# Altium project SprinklerBoard.PrjPCB
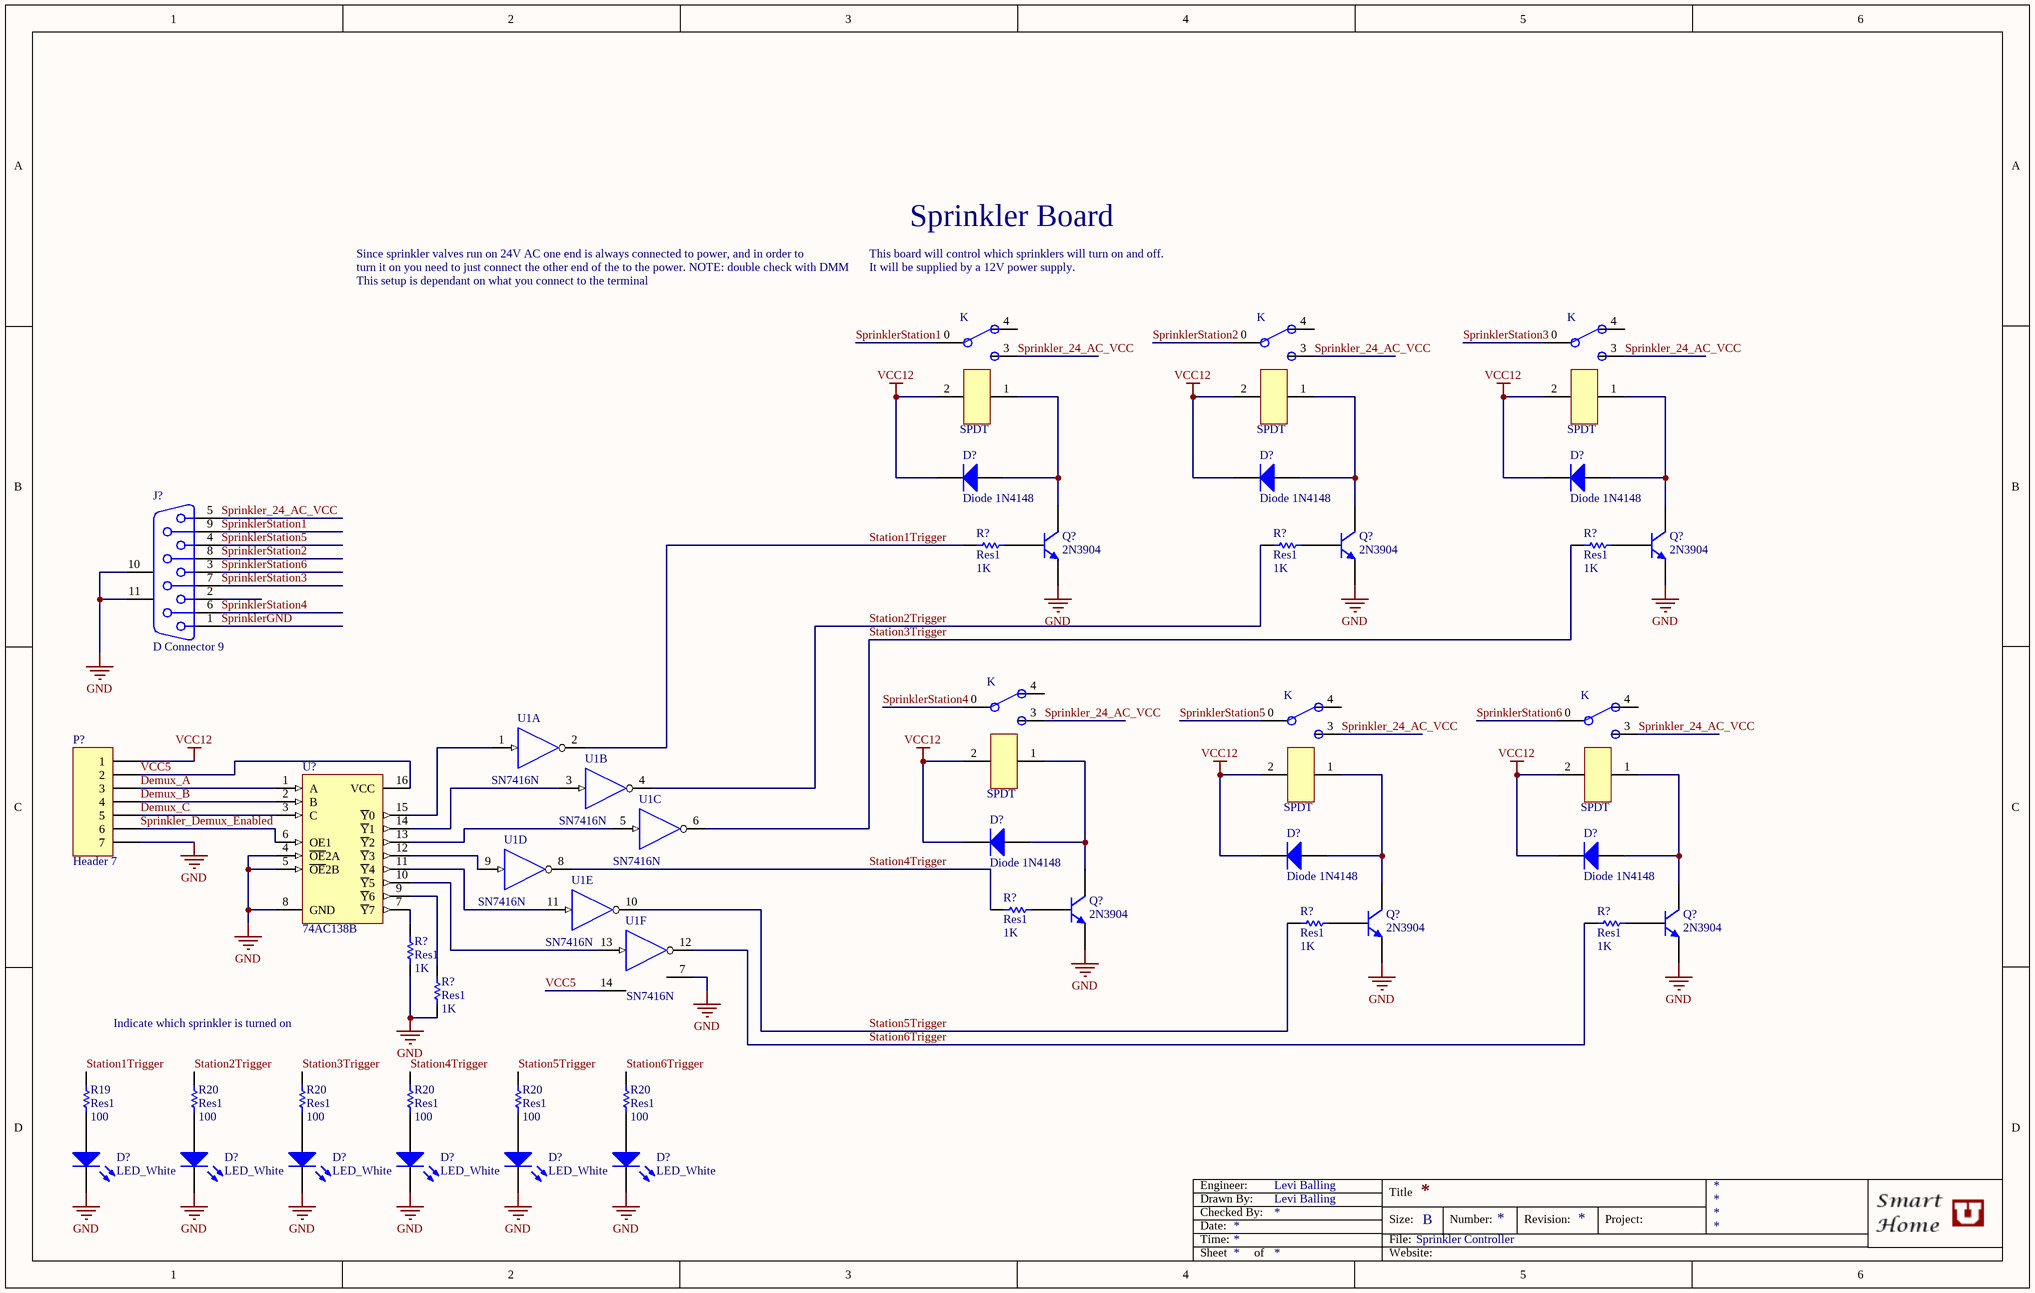
[diagram p0: SprinklerBoard.SchDoc]
1 sheet, 42 parts. Net scope: global (net labels, ports and power ports of the same name join across sheets).

## Sheet SprinklerBoard.SchDoc
size B; DrawnBy: Levi Balling; Engineer: Levi Balling; DocumentName: Sprinkler Controller

### Parts
(Parts that share a designator on the sheet are numbered #1, #2 ... from top to bottom, then left to right.)
D?#1  Diode 1N4148  [DO-35]
D?#2  Diode 1N4148  [DO-35]
D?#3  Diode 1N4148  [DO-35]
D?#4  Diode 1N4148  [DO-35]
D?#5  Diode 1N4148  [DO-35]
D?#6  Diode 1N4148  [DO-35]
D?#7  LED_White  [LED-0]
D?#8  LED_White  [LED-0]
D?#9  LED_White  [LED-0]
D?#10  LED_White  [LED-0]
D?#11  LED_White  [LED-0]
D?#12  LED_White  [LED-0]
J?  D Connector 9  [DSUB1.385-2H9]
K#1  SPDT  [Relay  SPDT]
K#2  SPDT  [Relay  SPDT]
K#3  SPDT  [Relay  SPDT]
K#4  SPDT  [Relay  SPDT]
K#5  SPDT  [Relay  SPDT]
K#6  SPDT  [Relay  SPDT]
P?  Header 7  [HDR1X7]
Q?#1  2N3904  [2N3904]
Q?#2  2N3904  [2N3904]
Q?#3  2N3904  [2N3904]
Q?#4  2N3904  [2N3904]
Q?#5  2N3904  [2N3904]
Q?#6  2N3904  [2N3904]
R19  Res1  value 100  [AXIAL-0.3]
R20#1  Res1  value 100  [AXIAL-0.3]
R20#2  Res1  value 100  [AXIAL-0.3]
R20#3  Res1  value 100  [AXIAL-0.3]
R20#4  Res1  value 100  [AXIAL-0.3]
R20#5  Res1  value 100  [AXIAL-0.3]
R?#1  Res1  value 1K  [AXIAL-0.3]
R?#2  Res1  value 1K  [AXIAL-0.3]
R?#3  Res1  value 1K  [AXIAL-0.3]
R?#4  Res1  value 1K  [AXIAL-0.3]
R?#5  Res1  value 1K  [AXIAL-0.3]
R?#6  Res1  value 1K  [AXIAL-0.3]
R?#7  Res1  value 1K  [AXIAL-0.3]
R?#8  Res1  value 1K  [AXIAL-0.3]
U1  SN7416N  [N014]  (parts A,B,C,D,E,F of 6)
U?  74AC138B  [DIP16]

### Nets
GND: D?#7.2(K) D?#8.2(K) D?#9.2(K) D?#10.2(K) D?#11.2(K) D?#12.2(K) J?.10(MH1) J?.11(MH2) P?.7 Q?#1.1(E) Q?#2.1(E) Q?#3.1(E) Q?#4.1(E) Q?#5.1(E) Q?#6.1(E) R?#7.1 R?#8.1 U1.7(GND) U?.4(~{OE}2A) U?.5(~{OE}2B) U?.8(GND)
VCC: U1.14(VCC)
VCC12: D?#1.2(K) D?#2.2(K) D?#3.2(K) D?#4.2(K) D?#5.2(K) D?#6.2(K) K#1.2 K#2.2 K#3.2 K#4.2 K#5.2 K#6.2 P?.1
Demux_A: P?.3 U?.1(A)
Demux_B: P?.4 U?.2(B)
Demux_C: P?.5 U?.3(C)
Sprinkler_24_AC_VCC: J?.5 K#1.3 K#2.3 K#3.3 K#4.3 K#5.3 K#6.3
Sprinkler_Demux_Enabled: P?.6 U?.6(OE1)
SprinklerGND: J?.1
SprinklerStation1: J?.9 K#1.0
SprinklerStation2: J?.8 K#2.0
SprinklerStation3: J?.7 K#3.0
SprinklerStation4: J?.6 K#4.0
SprinklerStation5: J?.4 K#5.0
SprinklerStation6: J?.3 K#6.0
Station1Trigger: R19.1 R?#1.2 U1.2(Y)
Station2Trigger: R20#1.1 R?#2.2 U1.4(Y)
Station3Trigger: R20#2.1 R?#3.2 U1.6(Y)
Station4Trigger: R20#3.1 R?#4.2 U1.8(Y)
Station5Trigger: R20#4.1 R?#5.2 U1.10(Y)
Station6Trigger: R20#5.1 R?#6.2 U1.12(Y)
VCC5: P?.2 U1.14(VCC) U?.16(VCC)
NetD?#1_1: D?#1.1(A) K#1.1 Q?#1.3(C)
NetD?#2_1: D?#2.1(A) K#2.1 Q?#2.3(C)
NetD?#3_1: D?#3.1(A) K#3.1 Q?#3.3(C)
NetD?#4_1: D?#4.1(A) K#4.1 Q?#4.3(C)
NetD?#5_1: D?#5.1(A) K#5.1 Q?#5.3(C)
NetD?#6_1: D?#6.1(A) K#6.1 Q?#6.3(C)
NetD?#7_1: D?#7.1(A) R19.2
NetD?#8_1: D?#8.1(A) R20#1.2
NetD?#9_1: D?#9.1(A) R20#2.2
NetD?#10_1: D?#10.1(A) R20#3.2
NetD?#11_1: D?#11.1(A) R20#4.2
NetD?#12_1: D?#12.1(A) R20#5.2
NetQ?#1_2: Q?#1.2(B) R?#1.1
NetQ?#2_2: Q?#2.2(B) R?#2.1
NetQ?#3_2: Q?#3.2(B) R?#3.1
NetQ?#4_2: Q?#4.2(B) R?#4.1
NetQ?#5_2: Q?#5.2(B) R?#5.1
NetQ?#6_2: Q?#6.2(B) R?#6.1
NetR?#7_2: R?#7.2 U?.7(~{Y}7)
NetR?#8_2: R?#8.2 U?.9(~{Y}6)
NetU1_1: U1.1(A) U?.15(~{Y}0)
NetU1_3: U1.3(A) U?.14(~{Y}1)
NetU1_5: U1.5(A) U?.13(~{Y}2)
NetU1_9: U1.9(A) U?.12(~{Y}3)
NetU1_11: U1.11(A) U?.11(~{Y}4)
NetU1_13: U1.13(A) U?.10(~{Y}5)

Not connected (* = marked no-connect by the designer): J? 2; K#1 4; K#2 4; K#3 4; K#4 4; K#5 4; K#6 4

### Notes on the sheet
- Sprinkler Board
- Since sprinkler valves run on 24V AC one end is always connected to power, and in order to
- turn it on you need to just connect the other end of the to the power. NOTE: double check with DMM
- This setup is dependant on what you connect to the terminal
- This board will control which sprinklers will turn on and off.
- It will be supplied by a 12V power supply.
- Indicate which sprinkler is turned on
- Date:
- Time:
- Engineer:
- Drawn By:
- Checked By:
- Title
- Size:
- File:
- B
- Number:
- Revision:
- Project:
- Sheet
- of
- Website:

### Library data of the parts
D?#1-D?#6 = Diode 1N4148: High Conductance Fast Diode; Published: 8-Jun-2000; LatestRevisionDate: 17-Jul-2002; LatestRevisionNote: Re-released for DXP Platform.; DatasheetVersion: 1997; PackageReference: DO-35; Publisher: Altium Limited; PackageDescription: Diode, Axial; Body 3.8 x 1.9 mm (LxDia. max), Lead Dia. 0.53 mm (max); Code_JEDEC: DO-204-AH; ComponentLink1Description: Manufacturer Link; ComponentLink1URL: http://www.fairchildsemi.com/; ComponentLink2Description: Datasheet; ComponentLink2URL: http://www.fairchildsemi.com/ds/1N%2F1N4148.pdf
D?#7-D?#12 = LED0: Typical INFRARED GaAs LED; Published: 8-Jun-2000; LatestRevisionDate: 08-Jul-2005; LatestRevisionNote: Mech Layer 1 removed.; PackageReference: LED-0; Publisher: Altium Limited; PackageDescription: LED; 2 Leads
J? = D Connector 9: Receptacle Assembly, 9 Position, Right Angle; PackageDocument: O; Positions: 9; Published: 15-Jun-2001; LatestRevisionDate: 17-Jul-2002; LatestRevisionNote: Re-released for DXP Platform.; DatasheetDocument: 1-Sep-1999; PackageReference: 788750; Publisher: Altium Limited; Orientation: Right Angle; Gender: Receptacle
P? = Header 7: Header, 7-Pin; LatestRevisionDate: 17-Jul-2002; LatestRevisionNote: Re-released for DXP Platform.; Publisher: Altium Limited
Q?#1-Q?#6 = 2N3904: NPN General Purpose Amplifier; Published: 8-Jun-2000; LatestRevisionDate: 15-Jan-2003; LatestRevisionNote: PCB Footprint 'BCY-W3/D4.7' replaced; DatasheetVersion: 1997; PackageVersion: Sep-1998; PackageReference: TO-92A; Publisher: Altium Limited; PackageDescription: TO, Flat Index; 3 In-Line, Axial Leads; Body Dia. 4.5mm; Leads 0.51 x 0.48 mm (max); ComponentLink1Description: Manufacturer Link; ComponentLink1URL: http://www.fairchildsemi.com/; ComponentLink2Description: Datasheet; ComponentLink2URL: http://www.fairchildsemi.com/ds/2N%2F2N3904.pdf
R19 R20#1-R20#5 R?#1-R?#8 = Res1: Resistor; Published: 8-Jun-2000; LatestRevisionDate: 17-Jul-2002; LatestRevisionNote: Re-released for DXP Platform.; PackageReference: AXIAL-0.3; Publisher: Altium Limited; PackageDescription: Axial Device, Thru-Hole; 2 Leads; 0.3 in Pin Spacing
U1 = SN7416N: Hex Inverter Buffer / Driver with High-Voltage Outputs; Published: 8-Jun-2000; LatestRevisionDate: 04-Mar-2005; LatestRevisionNote: Stylized 3D Model Added.; DatasheetVersion: Mar-1988; PackageVersion: Oct-1995; PackageReference: N014; Publisher: Altium Limited; PackageDescription: DIP; 14 Leads; Row Spacing 7.62 mm; Pitch 2.54 mm; ComponentLink1Description: Manufacturer Link; ComponentLink1URL: http://www.ti.com/; ComponentLink2Description: Datasheet; ComponentLink2URL: http://www-s.ti.com/sc/ds/sn5416.pdf; ComponentLink3Description: Packaging Specification; ComponentLink3URL: http://focus.ti.com/lit/ml/mpdi002c/mpdi002c.pdf
U? = 74AC138B: 3-to-8 Line Decoder Inverting; Published: 8-Jun-2000; LatestRevisionDate: 06-Jun-2005; LatestRevisionNote: Stylized 3D Model Added.; DatasheetVersion: Apr-1997; PackageVersion: Apr-1996; PackageReference: DIP16; Publisher: Altium Limited; PackageDescription: DIP; 16 Leads; Row Spacing 7.62 mm; Pitch 2.54 mm; ComponentLink1Description: Manufacturer Link; ComponentLink1URL: http://www.st.com/; ComponentLink2Description: Datasheet; ComponentLink2URL: http://www.st.com/stonline/products/literature/ds/4696/74ac138.pdf